# Altium schematic sheet 04. POWER SUPPLY.SchDoc
size A4; DocumentNumber: 3; SheetNumber: 3; SheetTotal: 4
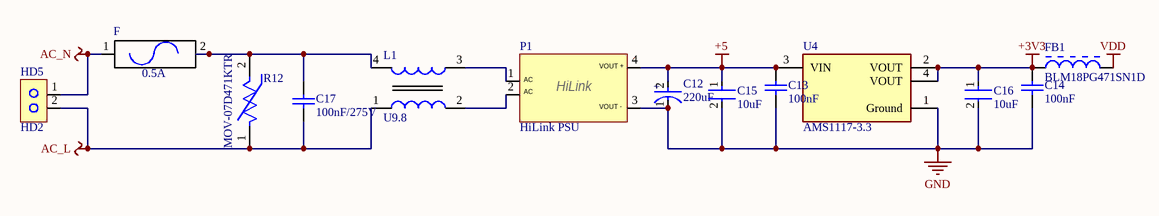
[diagram p0: 04. POWER SUPPLY.SchDoc]

## Parts
C12  220uF  [FP-ESTG4-MFG]
C13  100nF  [0603 CAP]
C14  100nF  [0603 CAP]
C15  10uF  [FP-CGA5L-0_3-0_1-IPC_B]
C16  10uF  [FP-CGA5L-0_3-0_1-IPC_B]
C17  100nF/275V  [CAP 12.5mm Pitch]
F  0.5A  [FUSE 20mm]
FB1  BLM18PG471SN1D  [0603 Ferrite]
HD5  HD2  [HD2 5.08mm]
L1  U9.8  [INDUCTOR FILTER U9.8]
P1  HiLink PSU  [HLK-5M05]
R12  MOV-07D471KTR  [FP-MOV-07D471KTR-MFG]
U4  AMS1117-3.3  [FP-AMS1117-IPC_C]

## Nets
+3V3: C14.2 C16.1 FB1.1 U4.2(VOUT) U4.4(VOUT)
+5: C12.2(A) C13.2 C15.1 P1.4 U4.3(VIN)
AC_L: C17.1 HD5.2 L1.1 R12.1
AC_N: F.1 HD5.1
GND: C12.1(C) C13.1 C14.1 C15.2 C16.2 P1.3 U4.1(Ground)
VDD: FB1.2
NetC17_2: C17.2 F.2 L1.4 R12.2
NetL1_2: L1.2 P1.2
NetL1_3: L1.3 P1.1

## Notes on the sheet
- Title
- Size:
- Date:
- A4
- Number:
- Time:
- Revision:
- Sheet
- of
- N.S.T
- Design by:
- Check by:
- https://github.com/tung080827
- (in symbol CMP-03015-000001-1) +
- (in symbol HiLink PSU) VOUT +; AC; HiLink; VOUT -

## Library data of the parts
C12 = CMP-03015-000001-1: CAP ALUM 220UF 20% 35V RADIAL; Manufacturer Part Number: EST227M035AG4AA; Manufacturer: Kemet; Leakage Current: 77uA; Life: 7000Hours; Ripple Current: 840mA; Dissipation Factor: 12%; Esr: 0.16Ω; Material: Aluminum; Value: 220uF; Category: Cap; Octopart: https://octopart.com/est227m035ag4aa-kemet-22264647; Device Class L3: Aluminum Electrolytic Capacitors; Mouser Description: Aluminum Electrolytic Capacitors - Leaded 35volts 220uF 20%; Digikey Description: CAP ALUM 220UF 20% 35V RADIAL; Lead Free: Yes; Device Class L2: Capacitors; Device Class L1: Passive Components; ComponentLink2URL: https://content.kemet.com/datasheets/KEM_A4010_EST.pdf; Voltage Rating: 35V; Temperature: -40°C to +105°C; Capacitance: 220uF; RoHS: TRUE; Temperature Range High: +105°C; Package: ESTG4; Temperature Range Low: -40°C; Height: 17mm; ComponentLink2Description: Datasheet; Automotive: No; Tolerance: 20%
C13 C14 = CMP-2100-03643-1: Chip Capacitor, 0.1 uF, +/- 10%, 50 V, -55 to 125 degC, 0603 (1608 Metric), RoHS, Tape and Reel; Manufacturer: Murata; Dielectric Material: Ceramic; Voltage Rating: 50V; Dielectric: X7R; Insulation Resistance: 10GR; Case Code (Metric): 1608; Lead Free: LeadFree; Depth: 0.8mm; Number of Pins: 2; Radiation Hardening: No; Case/Package: 0603; Manufacturer URL: http://www.murata.com/; Packaging: TapeandReel; Length: 1.6mm; Contact Plating: Tin; Datasheet URL: http://psearch.en.murata.com/capacitor/product/GRM188R71H104KA93%23.pdf; Tolerance: 10%; Case Code (Imperial): 0603; Min Operating Temperature: -55degC; RoHSCompliant: true; Capacitance: 100nF; Voltage: 50V; Termination: SMD/SMT; Mount: SurfaceMount; Material: Ceramic; Package Quantity: 1; Height: 0.8mm; Thickness: 0.035inch; REACH SVHC: NoSVHC; Max Operating Temperature: 125degC; Width: 0.8mm; Package Reference: 0603; Voltage Rating (DC): 50V; Datasheet Version: 42675.0; Package Description: 2-Pin Surface Mount Device, Body 1.6 x 0.8 mm
C15 C16 = CMP-08246-002126-1: Cap Ceramic 10uF 25V X7R 10% Pad SMD 1206 +125°C Automotive T/R; Case/Package: 1206; Thickness: 0.075inch; Ratings: AEC-Q200; Packaging: Tape and Reel; REACH SVHC: No SVHC; Composition: Ceramic; Tolerance: 10%; Capacitance: 10uF; Depth: 1.6mm; Lead Free: Lead Free; Termination: SMD/SMT; Package Quantity: 1; Dielectric: X7R; Length: 3.2mm; Min Operating Temperature: -55°C; Voltage Rating: 25V; Max Operating Temperature: 125°C; Mount: Surface Mount; Case Code (Metric): 3216; Height: 1.6mm; Weight: 0.000571oz; Width: 0.063inch; Voltage Rating (DC): 25V; Case Code (Imperial): 1206
C17 = CMP-2100-03643-1: Chip Capacitor, 0.1 uF, +/- 10%, 400 V, -55 to 125 degC, 0603 (1608 Metric), RoHS, Tape and Reel; Manufacturer: Murata; Dielectric Material: Ceramic; Voltage Rating: 50V; Capacitance: 100nF; Dielectric: X7R; Insulation Resistance: 10GR; Case Code (Metric): 1608; Lead Free: LeadFree; Depth: 0.8mm; Number of Pins: 2; Radiation Hardening: No; Case/Package: 0603; Manufacturer URL: http://www.murata.com/; Packaging: TapeandReel; Length: 1.6mm; Contact Plating: Tin; Datasheet URL: http://psearch.en.murata.com/capacitor/product/GRM188R71H104KA93%23.pdf; Tolerance: 10%; Case Code (Imperial): 0603; Min Operating Temperature: -55degC; RoHSCompliant: true; Voltage: 50V; Termination: SMD/SMT; Mount: SurfaceMount; Material: Ceramic; Package Quantity: 1; Height: 0.8mm; Thickness: 0.035inch; REACH SVHC: NoSVHC; Max Operating Temperature: 125degC; Width: 0.8mm; Package Reference: 0603; Voltage Rating (DC): 50V; Datasheet Version: 42675.0; Package Description: 2-Pin Surface Mount Device, Body 1.6 x 0.8 mm
F = FUSE
FB1 = CMP-0686-00587-2: Chip Ferrite Bead for Power Lines, 470 Ohm, 1000 mA, -55 to 125 degC, 1.6 x 0.8 x 0.95 mm SMD, Tape and Reel; Manufacturer: Murata; DC Resistance: 0.20 Ohm Max.; Rated Current: 1000 mA; Impedance (at 100 MHz): 470 Ohm +/- 25%; Mounting Technology: Surface Mount; ComponentLink3URL: http://www.murata.com/products/catalog/pdf/c31e.pdf; ComponentLink1URL: http://www.murata.com/; ComponentLink2URL: http://www.murata.com/products/catalog/pdf/c31e.pdf; ComponentLink3Description: Package Specification; PartNumber: BLM18PG471SN1D; ComponentLink1Description: Manufacturer URL; Packing: Tape and Reel; Operating Temperature Range: -55 to 125 degC; PackageReference: BLM18_H950-2; ComponentLink2Description: Datasheet; PackageDescription: 2-Pin Chip, Body 1.6 x 0.8 mm; DatasheetVersion: 08/2013
L1 = INDUCTOR FILTER
R12 = CMP-07402-000006-1: VARISTOR 470V 1.2KA DISC 7MM; Manufacturer: Bourns Inc.; Voltage Rating Ac: 300V; Varistor Voltage: 423V; Clamping Current: 10A; Voltage Rating Dc: 385V; Value: 126pF; Voltage Tolerance: 10%; Clamping Voltage: 775V; Package: 0; Octopart: https://octopart.com/mov-07d471ktr-bourns-19184728; Manufacturer Part Number: MOV-07D471KTR; Lead Free: Yes; RoHS: TRUE; Automotive: No; Device Class L2: Varistors; ComponentLink2URL: https://www.bourns.com/docs/product-datasheets/mov07d.pdf?sfvrsn=86ba81fd_26; Temperature Range Low: -40°C; Device Class L1: Circuit Protection; ComponentLink2Description: Datasheet; Device Class L3: unset; Temperature: -40°C to +105°C; Height: 11mm; Category: Res; Mouser Description: Varistors 105pF 470volts 10%; Temperature Range High: +105°C; Capacitance: 126pF; Digikey Description: VARISTOR 470V 1.2KA DISC 7MM
U4 = CMP-209535-000001-1: LDO Voltage Regulators 1A, 3.3V; Manufacturer: Advanced Monolithic Systems; Dropout Voltage: 1.1V; Output Type: Fixed; Nominal Supply Current: 5mA; Max Power Dissipation: 1.2W; Max Supply Voltage: 15V; Number Of Outputs: 1; Standoff Height: 0.64mm; Max Junction Temp: +125°C; Height: 1.8mm; Package: AMS1117; Device Class L2: Power Management ICs; ComponentLink2Description: Datasheet; ComponentLink2URL: http://www.advanced-monolithic.com/pdf/ds1117.pdf; Category: IC; RoHS: TRUE; Automotive: No; Device Class L1: Integrated Circuits (ICs); Output Current: 1A; Device Class L3: Voltage Regulators - Linear; Temperature: -40°C to +125°C; Output Voltage: 3.3V; Manufacturer Part Number: AMS1117-3.3; Temperature Range Low: -40°C; Octopart: https://octopart.com/ams1117-3.3-advanced+monolithic+systems-25899300; Lead Free: Yes; Ipc Land Pattern Name: SOT229P700X180-4; Temperature Range High: +125°C